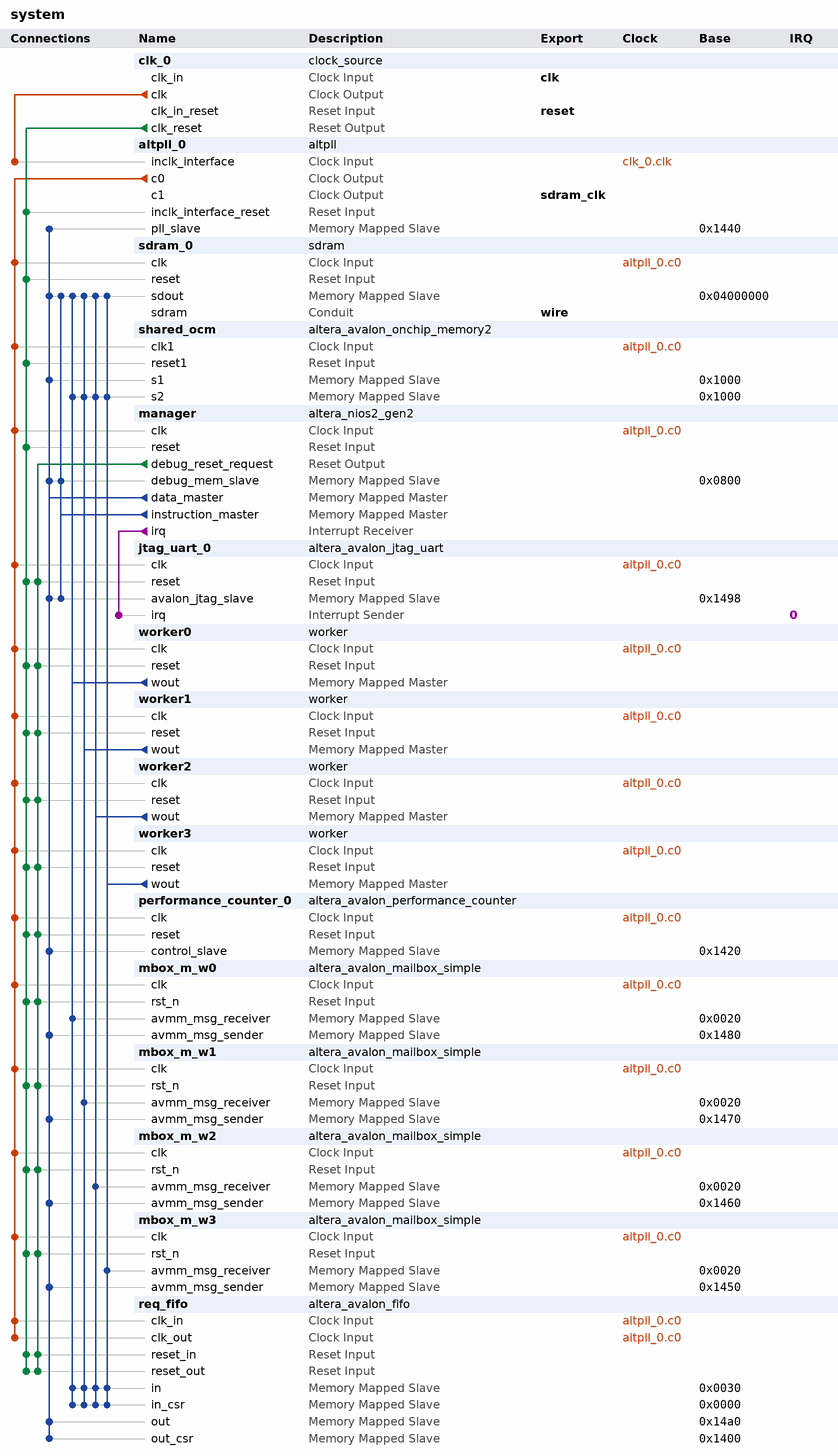
[diagram p0: system contents]
# Platform Designer (Qsys) system system, Cyclone IV E EP4CE22F17C6
# Parameters at their usual value, and those the tool derives, are not listed.
package require -exact qsys 17.1
create_system system
set_project_property DEVICE_FAMILY {Cyclone IV E}
set_project_property DEVICE EP4CE22F17C6

add_instance clk_0 clock_source 17.1
set_instance_parameter_value clk_0 clockFrequency 50000000

add_instance altpll_0 altpll 17.1
set_instance_parameter_value altpll_0 CLK0_DIVIDE_BY 1
set_instance_parameter_value altpll_0 CLK0_MULTIPLY_BY 1
set_instance_parameter_value altpll_0 CLK1_DIVIDE_BY 1
set_instance_parameter_value altpll_0 CLK1_DUTY_CYCLE 50
set_instance_parameter_value altpll_0 CLK1_MULTIPLY_BY 1
set_instance_parameter_value altpll_0 CLK1_PHASE_SHIFT 3000
set_instance_parameter_value altpll_0 INCLK0_INPUT_FREQUENCY 20000
set_instance_parameter_value altpll_0 PORT_ARESET PORT_UNUSED
set_instance_parameter_value altpll_0 PORT_LOCKED PORT_UNUSED
set_instance_parameter_value altpll_0 PORT_clk1 PORT_USED
set_instance_parameter_value altpll_0 PORT_clk2 PORT_UNUSED
set_instance_parameter_value altpll_0 PORT_clk3 PORT_UNUSED

add_instance sdram_0 sdram 1.0

add_instance shared_ocm altera_avalon_onchip_memory2 17.1
set_instance_parameter_value shared_ocm dataWidth 32
set_instance_parameter_value shared_ocm dualPort true
set_instance_parameter_value shared_ocm initMemContent false
set_instance_parameter_value shared_ocm initializationFileName onchip_mem.hex
set_instance_parameter_value shared_ocm memorySize 1024
set_instance_parameter_value shared_ocm singleClockOperation true

add_instance manager altera_nios2_gen2 17.1
set_instance_parameter_value manager cpuID 1
set_instance_parameter_value manager dcache_size 2048
set_instance_parameter_value manager exceptionSlave sdram_0_sdram.s1
set_instance_parameter_value manager icache_size 4096
set_instance_parameter_value manager impl Fast
set_instance_parameter_value manager resetSlave sdram_0_sdram.s1

add_instance jtag_uart_0 altera_avalon_jtag_uart 17.1
set_instance_parameter_value jtag_uart_0 simInteractiveOptions NO_INTERACTIVE_WINDOWS

add_instance worker0 worker 1.0
set_instance_parameter_value worker0 cpu_id 16
set_instance_parameter_value worker0 exception_vector 68157472
set_instance_parameter_value worker0 reset_vector 68157440

add_instance worker1 worker 1.0
set_instance_parameter_value worker1 cpu_id 32
set_instance_parameter_value worker1 exception_vector 68681760
set_instance_parameter_value worker1 reset_vector 68681728

add_instance worker2 worker 1.0
set_instance_parameter_value worker2 cpu_id 64
set_instance_parameter_value worker2 exception_vector 69206048
set_instance_parameter_value worker2 reset_vector 69206016

add_instance worker3 worker 1.0
set_instance_parameter_value worker3 cpu_id 128
set_instance_parameter_value worker3 exception_vector 69730336
set_instance_parameter_value worker3 reset_vector 69730304

add_instance performance_counter_0 altera_avalon_performance_counter 17.1
set_instance_parameter_value performance_counter_0 numberOfSections 1

add_instance mbox_m_w0 altera_avalon_mailbox_simple 17.1
set_instance_parameter_value mbox_m_w0 AWIDTH 2
set_instance_parameter_value mbox_m_w0 DWIDTH 32
set_instance_parameter_value mbox_m_w0 MSG_ARRIVAL_NOTIFY 0
set_instance_parameter_value mbox_m_w0 MSG_SPACE_NOTIFY 0

add_instance mbox_m_w1 altera_avalon_mailbox_simple 17.1
set_instance_parameter_value mbox_m_w1 AWIDTH 2
set_instance_parameter_value mbox_m_w1 DWIDTH 32
set_instance_parameter_value mbox_m_w1 MSG_ARRIVAL_NOTIFY 0
set_instance_parameter_value mbox_m_w1 MSG_SPACE_NOTIFY 0

add_instance mbox_m_w2 altera_avalon_mailbox_simple 17.1
set_instance_parameter_value mbox_m_w2 AWIDTH 2
set_instance_parameter_value mbox_m_w2 DWIDTH 32
set_instance_parameter_value mbox_m_w2 MSG_ARRIVAL_NOTIFY 0
set_instance_parameter_value mbox_m_w2 MSG_SPACE_NOTIFY 0

add_instance mbox_m_w3 altera_avalon_mailbox_simple 17.1
set_instance_parameter_value mbox_m_w3 AWIDTH 2
set_instance_parameter_value mbox_m_w3 DWIDTH 32
set_instance_parameter_value mbox_m_w3 MSG_ARRIVAL_NOTIFY 0
set_instance_parameter_value mbox_m_w3 MSG_SPACE_NOTIFY 0

add_instance req_fifo altera_avalon_fifo 17.1
set_instance_parameter_value req_fifo bitsPerSymbol 16
set_instance_parameter_value req_fifo channelWidth 8
set_instance_parameter_value req_fifo errorWidth 8
set_instance_parameter_value req_fifo fifoDepth 16
set_instance_parameter_value req_fifo fifoInputInterfaceOptions AVALONMM_WRITE
set_instance_parameter_value req_fifo fifoOutputInterfaceOptions AVALONMM_READ
set_instance_parameter_value req_fifo singleClockMode false
set_instance_parameter_value req_fifo symbolsPerBeat 2
set_instance_parameter_value req_fifo useIRQ false
set_instance_parameter_value req_fifo usePacket true
set_instance_parameter_value req_fifo useReadControl true

# connections
add_connection altpll_0.c0 jtag_uart_0.clk clock
add_connection altpll_0.c0 manager.clk clock
add_connection altpll_0.c0 mbox_m_w0.clk clock
add_connection altpll_0.c0 mbox_m_w1.clk clock
add_connection altpll_0.c0 mbox_m_w2.clk clock
add_connection altpll_0.c0 mbox_m_w3.clk clock
add_connection altpll_0.c0 performance_counter_0.clk clock
add_connection altpll_0.c0 req_fifo.clk_in clock
add_connection altpll_0.c0 req_fifo.clk_out clock
add_connection altpll_0.c0 sdram_0.clk clock
add_connection altpll_0.c0 shared_ocm.clk1 clock
add_connection altpll_0.c0 worker0.clk clock
add_connection altpll_0.c0 worker1.clk clock
add_connection altpll_0.c0 worker2.clk clock
add_connection altpll_0.c0 worker3.clk clock
add_connection clk_0.clk altpll_0.inclk_interface clock
add_connection clk_0.clk_reset altpll_0.inclk_interface_reset reset
add_connection clk_0.clk_reset jtag_uart_0.reset reset
add_connection clk_0.clk_reset manager.reset reset
add_connection clk_0.clk_reset mbox_m_w0.rst_n reset
add_connection clk_0.clk_reset mbox_m_w1.rst_n reset
add_connection clk_0.clk_reset mbox_m_w2.rst_n reset
add_connection clk_0.clk_reset mbox_m_w3.rst_n reset
add_connection clk_0.clk_reset performance_counter_0.reset reset
add_connection clk_0.clk_reset req_fifo.reset_in reset
add_connection clk_0.clk_reset req_fifo.reset_out reset
add_connection clk_0.clk_reset sdram_0.reset reset
add_connection clk_0.clk_reset shared_ocm.reset1 reset
add_connection clk_0.clk_reset worker0.reset reset
add_connection clk_0.clk_reset worker1.reset reset
add_connection clk_0.clk_reset worker2.reset reset
add_connection clk_0.clk_reset worker3.reset reset
add_connection manager.debug_reset_request jtag_uart_0.reset reset
add_connection manager.debug_reset_request mbox_m_w0.rst_n reset
add_connection manager.debug_reset_request mbox_m_w1.rst_n reset
add_connection manager.debug_reset_request mbox_m_w2.rst_n reset
add_connection manager.debug_reset_request mbox_m_w3.rst_n reset
add_connection manager.debug_reset_request performance_counter_0.reset reset
add_connection manager.debug_reset_request req_fifo.reset_in reset
add_connection manager.debug_reset_request req_fifo.reset_out reset
add_connection manager.debug_reset_request worker0.reset reset
add_connection manager.debug_reset_request worker1.reset reset
add_connection manager.debug_reset_request worker2.reset reset
add_connection manager.debug_reset_request worker3.reset reset
add_connection manager.data_master altpll_0.pll_slave avalon
set_connection_parameter_value manager.data_master/altpll_0.pll_slave baseAddress 0x1440
add_connection manager.data_master jtag_uart_0.avalon_jtag_slave avalon
set_connection_parameter_value manager.data_master/jtag_uart_0.avalon_jtag_slave baseAddress 0x1498
add_connection manager.data_master manager.debug_mem_slave avalon
set_connection_parameter_value manager.data_master/manager.debug_mem_slave baseAddress 0x0800
add_connection manager.data_master mbox_m_w0.avmm_msg_sender avalon
set_connection_parameter_value manager.data_master/mbox_m_w0.avmm_msg_sender baseAddress 0x1480
add_connection manager.data_master mbox_m_w1.avmm_msg_sender avalon
set_connection_parameter_value manager.data_master/mbox_m_w1.avmm_msg_sender baseAddress 0x1470
add_connection manager.data_master mbox_m_w2.avmm_msg_sender avalon
set_connection_parameter_value manager.data_master/mbox_m_w2.avmm_msg_sender baseAddress 0x1460
add_connection manager.data_master mbox_m_w3.avmm_msg_sender avalon
set_connection_parameter_value manager.data_master/mbox_m_w3.avmm_msg_sender baseAddress 0x1450
add_connection manager.data_master performance_counter_0.control_slave avalon
set_connection_parameter_value manager.data_master/performance_counter_0.control_slave baseAddress 0x1420
add_connection manager.data_master req_fifo.out avalon
set_connection_parameter_value manager.data_master/req_fifo.out baseAddress 0x14a0
add_connection manager.data_master req_fifo.out_csr avalon
set_connection_parameter_value manager.data_master/req_fifo.out_csr baseAddress 0x1400
add_connection manager.data_master sdram_0.sdout avalon
set_connection_parameter_value manager.data_master/sdram_0.sdout baseAddress 0x04000000
add_connection manager.data_master shared_ocm.s1 avalon
set_connection_parameter_value manager.data_master/shared_ocm.s1 baseAddress 0x1000
add_connection manager.instruction_master jtag_uart_0.avalon_jtag_slave avalon
set_connection_parameter_value manager.instruction_master/jtag_uart_0.avalon_jtag_slave baseAddress 0x1498
add_connection manager.instruction_master manager.debug_mem_slave avalon
set_connection_parameter_value manager.instruction_master/manager.debug_mem_slave baseAddress 0x0800
add_connection manager.instruction_master sdram_0.sdout avalon
set_connection_parameter_value manager.instruction_master/sdram_0.sdout baseAddress 0x04000000
add_connection worker0.wout mbox_m_w0.avmm_msg_receiver avalon
set_connection_parameter_value worker0.wout/mbox_m_w0.avmm_msg_receiver baseAddress 0x0020
add_connection worker0.wout req_fifo.in avalon
set_connection_parameter_value worker0.wout/req_fifo.in baseAddress 0x0030
add_connection worker0.wout req_fifo.in_csr avalon
set_connection_parameter_value worker0.wout/req_fifo.in_csr baseAddress 0x0000
add_connection worker0.wout sdram_0.sdout avalon
set_connection_parameter_value worker0.wout/sdram_0.sdout baseAddress 0x04000000
add_connection worker0.wout shared_ocm.s2 avalon
set_connection_parameter_value worker0.wout/shared_ocm.s2 baseAddress 0x1000
add_connection worker1.wout mbox_m_w1.avmm_msg_receiver avalon
set_connection_parameter_value worker1.wout/mbox_m_w1.avmm_msg_receiver baseAddress 0x0020
add_connection worker1.wout req_fifo.in avalon
set_connection_parameter_value worker1.wout/req_fifo.in baseAddress 0x0030
add_connection worker1.wout req_fifo.in_csr avalon
set_connection_parameter_value worker1.wout/req_fifo.in_csr baseAddress 0x0000
add_connection worker1.wout sdram_0.sdout avalon
set_connection_parameter_value worker1.wout/sdram_0.sdout baseAddress 0x04000000
add_connection worker1.wout shared_ocm.s2 avalon
set_connection_parameter_value worker1.wout/shared_ocm.s2 baseAddress 0x1000
add_connection worker2.wout mbox_m_w2.avmm_msg_receiver avalon
set_connection_parameter_value worker2.wout/mbox_m_w2.avmm_msg_receiver baseAddress 0x0020
add_connection worker2.wout req_fifo.in avalon
set_connection_parameter_value worker2.wout/req_fifo.in baseAddress 0x0030
add_connection worker2.wout req_fifo.in_csr avalon
set_connection_parameter_value worker2.wout/req_fifo.in_csr baseAddress 0x0000
add_connection worker2.wout sdram_0.sdout avalon
set_connection_parameter_value worker2.wout/sdram_0.sdout baseAddress 0x04000000
add_connection worker2.wout shared_ocm.s2 avalon
set_connection_parameter_value worker2.wout/shared_ocm.s2 baseAddress 0x1000
add_connection worker3.wout mbox_m_w3.avmm_msg_receiver avalon
set_connection_parameter_value worker3.wout/mbox_m_w3.avmm_msg_receiver baseAddress 0x0020
add_connection worker3.wout req_fifo.in avalon
set_connection_parameter_value worker3.wout/req_fifo.in baseAddress 0x0030
add_connection worker3.wout req_fifo.in_csr avalon
set_connection_parameter_value worker3.wout/req_fifo.in_csr baseAddress 0x0000
add_connection worker3.wout sdram_0.sdout avalon
set_connection_parameter_value worker3.wout/sdram_0.sdout baseAddress 0x04000000
add_connection worker3.wout shared_ocm.s2 avalon
set_connection_parameter_value worker3.wout/shared_ocm.s2 baseAddress 0x1000
add_connection manager.irq jtag_uart_0.irq interrupt
set_connection_parameter_value manager.irq/jtag_uart_0.irq irqNumber 0

# exported interfaces
add_interface clk clock sink
set_interface_property clk EXPORT_OF clk_0.clk_in
add_interface reset reset sink
set_interface_property reset EXPORT_OF clk_0.clk_in_reset
add_interface sdram_clk clock source
set_interface_property sdram_clk EXPORT_OF altpll_0.c1
add_interface wire conduit end
set_interface_property wire EXPORT_OF sdram_0.sdram

set_interconnect_requirement {$system} qsys_mm.clockCrossingAdapter HANDSHAKE
set_interconnect_requirement {$system} qsys_mm.enableEccProtection FALSE
set_interconnect_requirement {$system} qsys_mm.insertDefaultSlave FALSE
set_interconnect_requirement {$system} qsys_mm.maxAdditionalLatency 1

save_system system.qsys
